# Altium schematic sheet power_supply.SchDoc
size A3
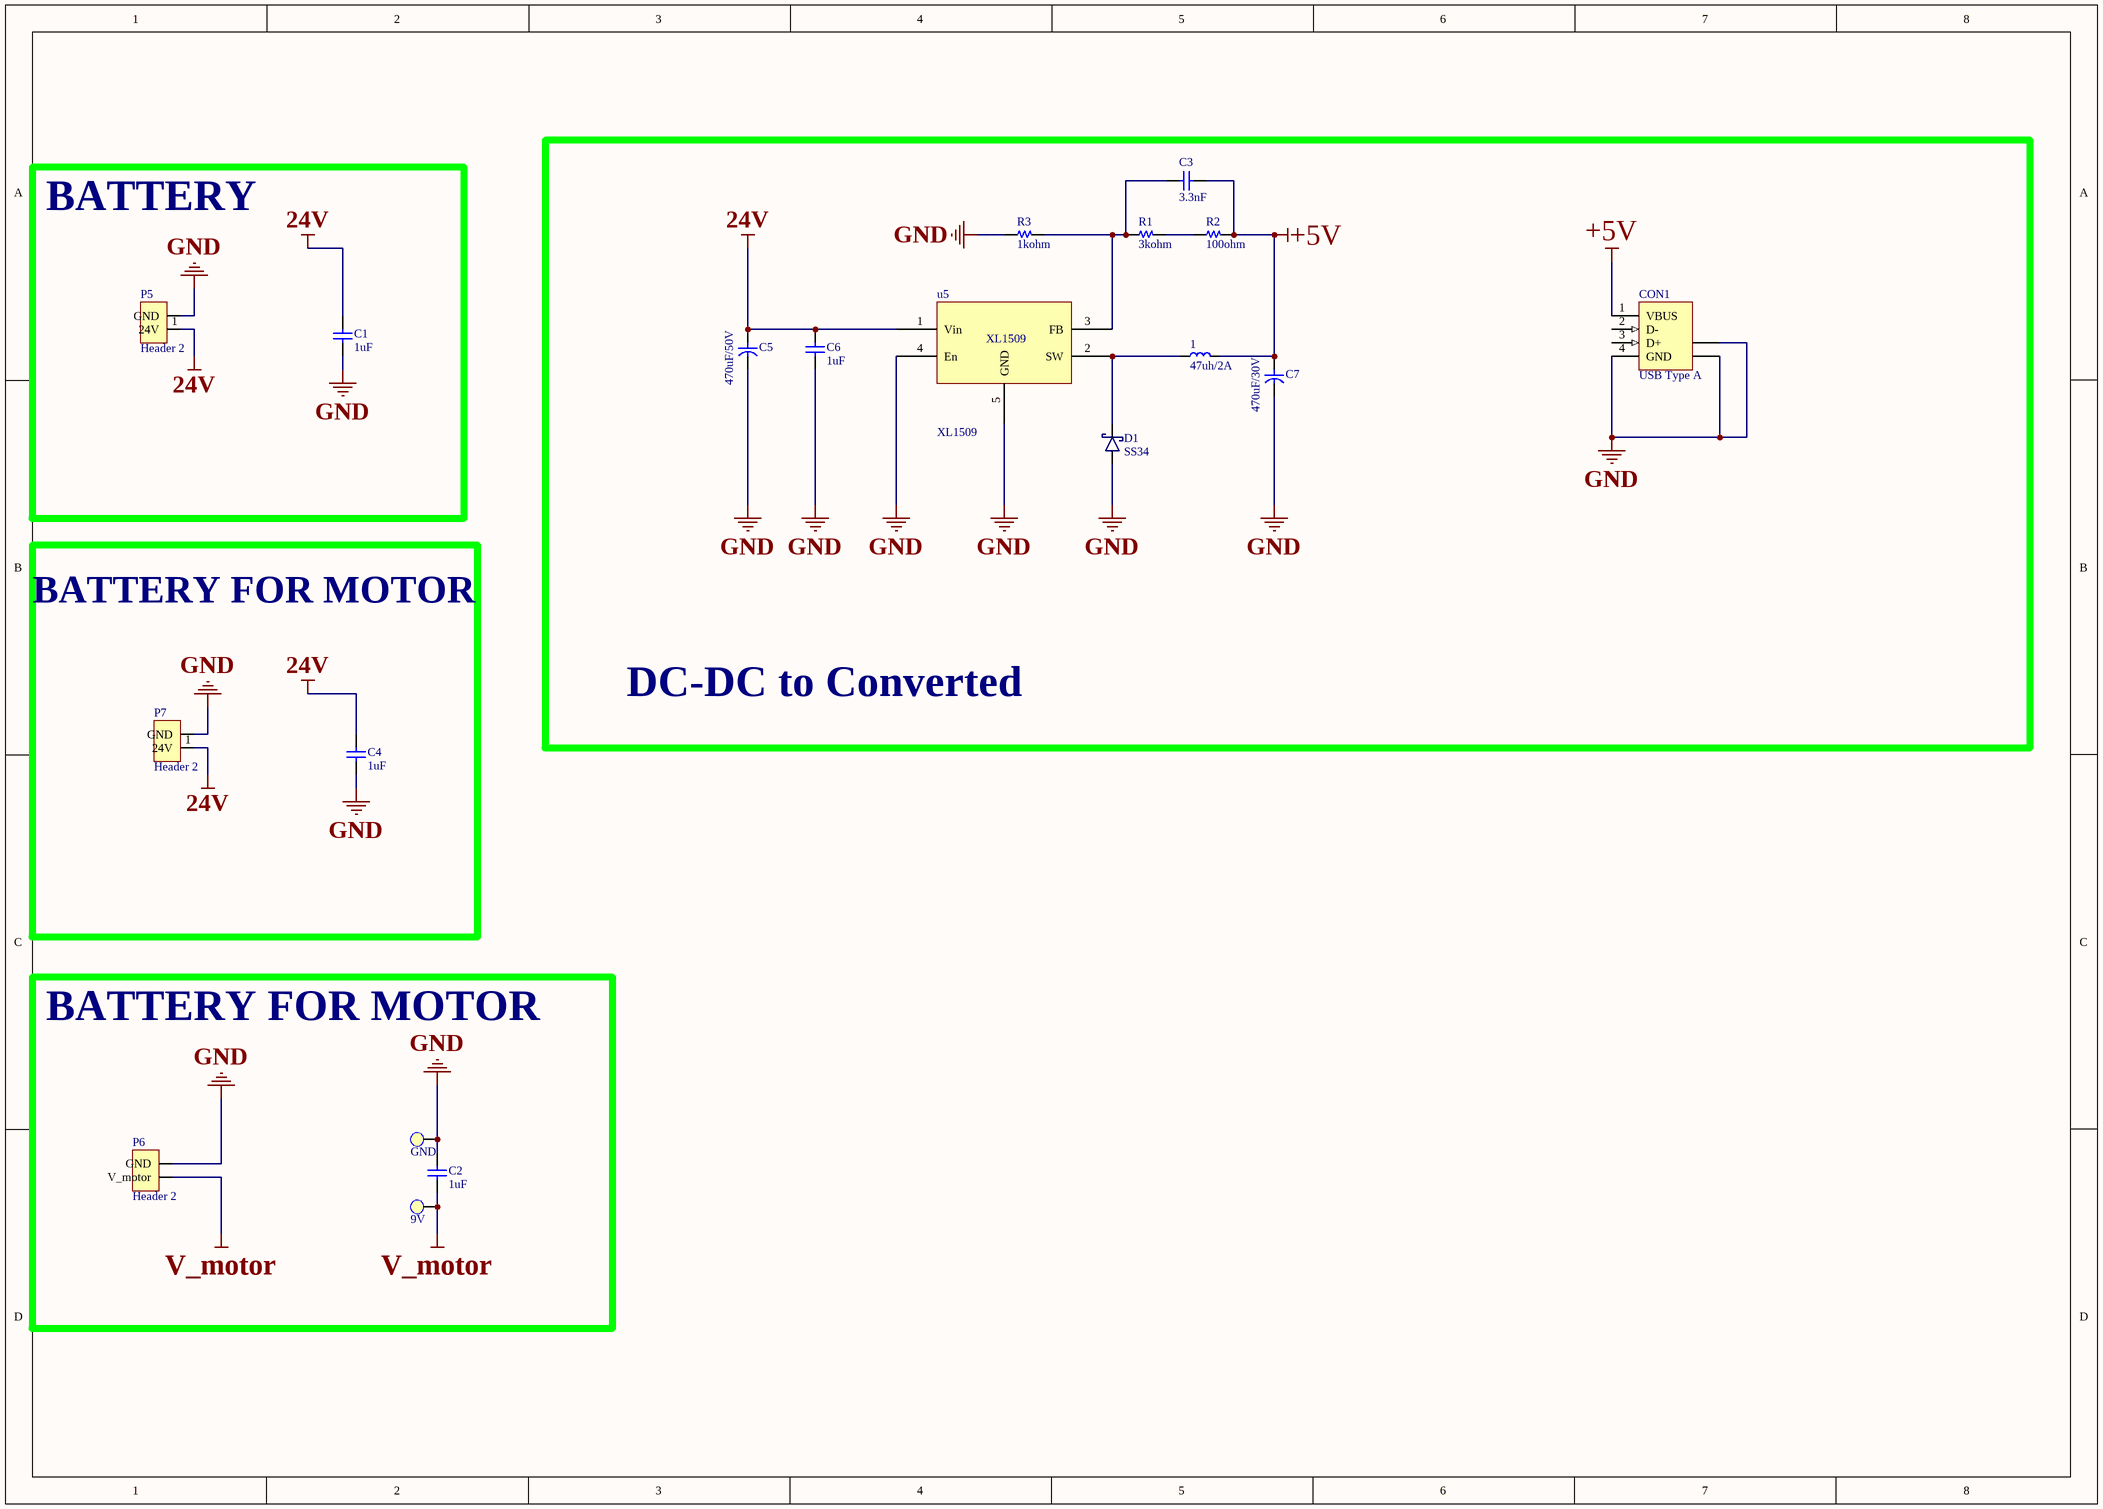
[diagram p0: power_supply.SchDoc]

## Parts
1  47uh/2A  [L/D8H10]
C1  1uF  [C 0603]
C2  1uF  [C 0603]
C3  3.3nF  [C 0805]
C4  1uF  [C 0603]
C5  470uF/50V  [CAP/D80/H125/LS30]
C6  1uF  [C 0603]
C7  470uF/30V  [CAP/D80/H125/LS30]
CON1  USB Type A  [CONN/USB/A/FEMALE/RA]
D1  SS34  [DIODE_SMA]
GND  GND  [TestPoint/SMD/1.5mm]  (no BOM)
P5  Header 2  [HDR/Header/2/2mm]
P6  Header 2  [HDR/Header/2/2mm]
P7  Header 2  [HDR/Header/2/2mm]
R1  3kohm  [R 0805]
R2  100ohm  [R 0805]
R3  1kohm  [R 0805]
u5  XL1509  [SO8]
V_MOTOR  9V  [TestPoint/SMD/1.5mm]  (no BOM)

## Blocks framed on the sheet
BATTERY: C1 P5
DC-DC to Converted: 1 C3 C5-C7 CON1 D1 R1-R3 u5
BATTERY FOR MOTOR: C4 P7
BATTERY FOR MOTOR: C2 GND P6 V_MOTOR

## Nets
24V: C1.1 C4.1 C5.1 C6.1 P5.1(24V) P7.1(24V) u5.1(Vin)
+5V: 1.2 C3.2 C7.1 CON1.1(VBUS) R2.2
GND: C1.2 C2.1 C4.2 C5.2 C6.2 C7.2 CON1.4(GND) CON1.5(SHLD) CON1.6(SHLD) D1.1 GND.1(TP) P5.2(GND) P6.2(GND) P7.2(GND) R3.1 u5.4(En) u5.5(GND)
V_motor: C2.2 P6.1(V_motor) V_MOTOR.1(TP)
Net1_1: 1.1 D1.2 u5.2(SW)
NetC3_1: C3.1 R1.1 R3.2 u5.3(FB)
NetR1_2: R1.2 R2.1

Not connected (* = marked no-connect by the designer): CON1 2(D-) 3(D+)

## Library data of the parts
1 = Inductor
C1-C4 C6 = Capacitor NP: Capacitor non-pol
C5 C7 = Capacitor: Capacitor pol
CON1 = CON USB Type A: USB type A, 4 pins
D1 = SS34: Rectifier Schottky 40V 3A SMA; Mouser PN: 512-SS34; ComponentLink1Description: Datasheet; Digikey PN: SS34FSTR-ND; JLCPCB: C2909963
GND V_MOTOR = Test Point: TYPE: NO-BOM; UNIT PRICE: 0
P5-P7 = Header 2: Header, 2-Pin
R1-R3 = Resistor
u5 = XL1509: pin to pad: 5>5+6+7+8